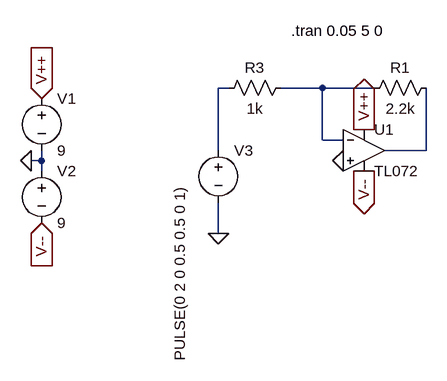
[diagram p0: schematic InversorAmp.asc]
InversorAmp.asc, the LTspice schematic file:
Version 4
SHEET 1 880 680
WIRE 224 144 208 144
WIRE 368 144 304 144
WIRE 448 144 368 144
WIRE 368 224 368 144
WIRE 400 224 368 224
WIRE 208 240 208 144
WIRE 528 240 528 144
WIRE 528 240 464 240
WIRE -64 256 -64 240
WIRE -64 256 -80 256
WIRE -64 272 -64 256
WIRE 208 368 208 320
FLAG -80 256 0
FLAG -64 160 V++
IOPIN -64 160 In
FLAG -64 352 V--
IOPIN -64 352 In
FLAG 208 368 0
FLAG 432 272 V--
IOPIN 432 272 Out
FLAG 432 208 V++
IOPIN 432 208 Out
FLAG 400 256 0
SYMBOL Voltage -64 144 R0
SYMATTR InstName V1
SYMATTR Value 9
SYMBOL Voltage -64 256 R0
SYMATTR InstName V2
SYMATTR Value 9
SYMBOL Voltage 208 224 R0
WINDOW 3 -59 70 VRight 2
SYMATTR Value PULSE(0 2 0 0.5 0.5 0 1)
SYMATTR InstName V3
SYMBOL OpAmps/TL072 432 176 R0
SYMATTR InstName U1
SYMBOL Res 544 128 R90
WINDOW 0 0 56 VBottom 2
WINDOW 3 32 56 VTop 2
SYMATTR InstName R1
SYMATTR Value 2.2k
SYMBOL Res 320 128 R90
WINDOW 0 0 56 VBottom 2
WINDOW 3 32 56 VTop 2
SYMATTR InstName R3
SYMATTR Value 1k
TEXT 320 56 Left 2 !.tran 0.05 5 0

The netlist it stands for:
* InversorAmp.asc
V1 V++ 0 9
V2 0 V-- 9
V3 N001 0 PULSE(0 2 0 0.5 0.5 0 1)
XU1 0 N002 V++ V-- N003 TL072  ; pins In+ In- V+ V- OUT
R1 N003 N002 2.2k
R3 N002 N001 1k
.tran 0.05 5 0
.backanno
.end